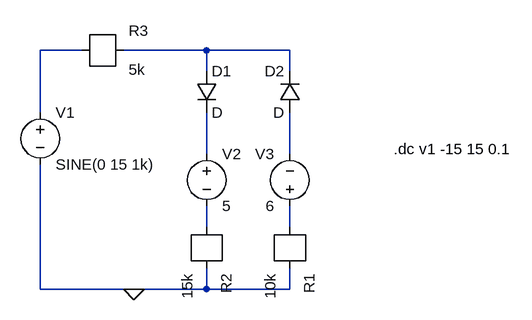
[diagram p0: schematic Draft1.asc]
Draft1.asc, the LTspice schematic file:
Version 4
SHEET 1 880 680
WIRE 0 176 -64 176
WIRE 192 176 64 176
WIRE 320 176 192 176
WIRE 192 208 192 176
WIRE 320 208 320 176
WIRE -64 272 -64 176
WIRE 192 336 192 272
WIRE 320 336 320 272
WIRE 192 448 192 416
WIRE 320 448 320 416
WIRE -64 544 -64 352
WIRE 80 544 -64 544
WIRE 192 544 192 512
WIRE 192 544 80 544
WIRE 320 544 320 512
WIRE 320 544 192 544
FLAG 80 544 0
SYMBOL voltage -64 256 R0
SYMATTR InstName V1
SYMATTR Value SINE(0 15 1k)
SYMATTR SpiceLine Rser=100k
SYMBOL voltage 192 320 R0
SYMATTR InstName V2
SYMATTR Value 5
SYMBOL diode 176 208 R0
SYMATTR InstName D1
SYMBOL voltage 320 432 R180
WINDOW 0 24 96 Left 2
WINDOW 3 24 16 Left 2
SYMATTR InstName V3
SYMATTR Value 6
SYMBOL diode 336 272 R180
WINDOW 0 24 64 Left 2
WINDOW 3 24 0 Left 2
SYMATTR InstName D2
SYMBOL r 320 448 R90
SYMATTR InstName R1
SYMATTR Value 10k
SYMBOL r 192 448 R90
SYMATTR InstName R2
SYMATTR Value 15k
SYMBOL r 0 176 R0
SYMATTR InstName R3
SYMATTR Value 5k
TEXT 480 328 Left 2 !.dc v1 -15 15 0.1

The netlist it stands for:
* Draft1.asc
V1 N001 0 SINE(0 15 1k) Rser=100k
V2 N003 N005 5
D1 N002 N003 D
V3 N006 N004 6
D2 N004 N002 D
R1 0 N006 10k
R2 0 N005 15k
R3 N002 N001 5k
.model D D
.lib standard.dio
.dc v1 -15 15 0.1
.backanno
.end